# Altium schematic sheet LED_Array.SchDoc
size A; SheetNumber: 1; SheetTotal: 1
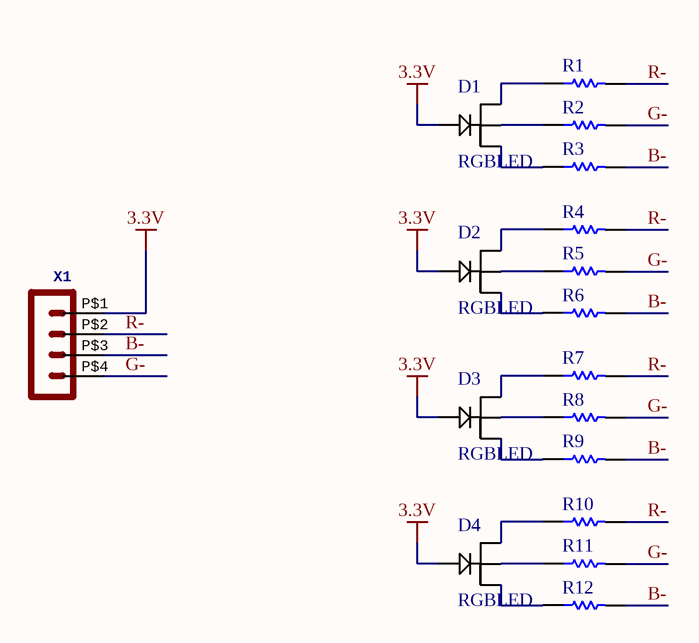
[diagram p0: LED_Array.SchDoc]

## Parts
D1  RGBLED  [RGBLED]
D2  RGBLED  [RGBLED]
D3  RGBLED  [RGBLED]
D4  RGBLED  [RGBLED]
R1  Res1  [AXIAL-0.3]  (value not drawn)
R2  Res1  [AXIAL-0.3]  (value not drawn)
R3  Res1  [AXIAL-0.3]  (value not drawn)
R4  Res1  [AXIAL-0.3]  (value not drawn)
R5  Res1  [AXIAL-0.3]  (value not drawn)
R6  Res1  [AXIAL-0.3]  (value not drawn)
R7  Res1  [AXIAL-0.3]  (value not drawn)
R8  Res1  [AXIAL-0.3]  (value not drawn)
R9  Res1  [AXIAL-0.3]  (value not drawn)
R10  Res1  [AXIAL-0.3]  (value not drawn)
R11  Res1  [AXIAL-0.3]  (value not drawn)
R12  Res1  [AXIAL-0.3]  (value not drawn)
X1  Molex - Micro-Fit 3.0 Series connector,  3.00mm (0.118") pitch header, 4 positions.  [43650-0400]  (value not drawn)

## Nets
3.3V: D1.0 D2.0 D3.0 D4.0 X1.P$1
B-: R3.2 R6.2 R9.2 R12.2 X1.P$3
G-: R2.2 R5.2 R8.2 R11.2 X1.P$4
R-: R1.2 R4.2 R7.2 R10.2 X1.P$2
NetD1_1: D1.1(R-) R1.1
NetD1_2: D1.2(G-) R2.1
NetD1_3: D1.3(B-) R3.1
NetD2_1: D2.1(R-) R4.1
NetD2_2: D2.2(G-) R5.1
NetD2_3: D2.3(B-) R6.1
NetD3_1: D3.1(R-) R7.1
NetD3_2: D3.2(G-) R8.1
NetD3_3: D3.3(B-) R9.1
NetD4_1: D4.1(R-) R10.1
NetD4_2: D4.2(G-) R11.1
NetD4_3: D4.3(B-) R12.1

## Library data of the parts
R1-R12 = Res1: Resistor; Published: 8-Jun-2000; LatestRevisionDate: 17-Jul-2002; LatestRevisionNote: Re-released for DXP Platform.; PackageReference: AXIAL-0.3; Publisher: Altium Limited; PackageDescription: Axial Device, Thru-Hole; 2 Leads; 0.3 in Pin Spacing
X1 = HEADER_POS4_?43650-0400: GateName_1: G$1; DeviceName: 43650-0409; SymbolName_1: HEADER_POS4; LibraryName: con-molex-micro-fit-3_0_2; DeviceSetName: HEADER_POS4_?; Package: 43650-0409